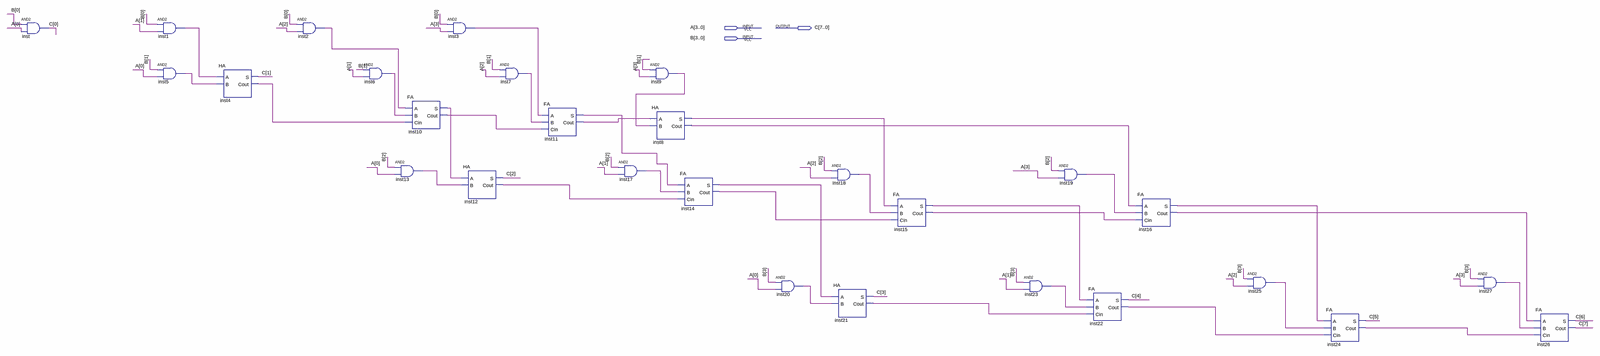
[diagram p0: schematic sheet, whole]
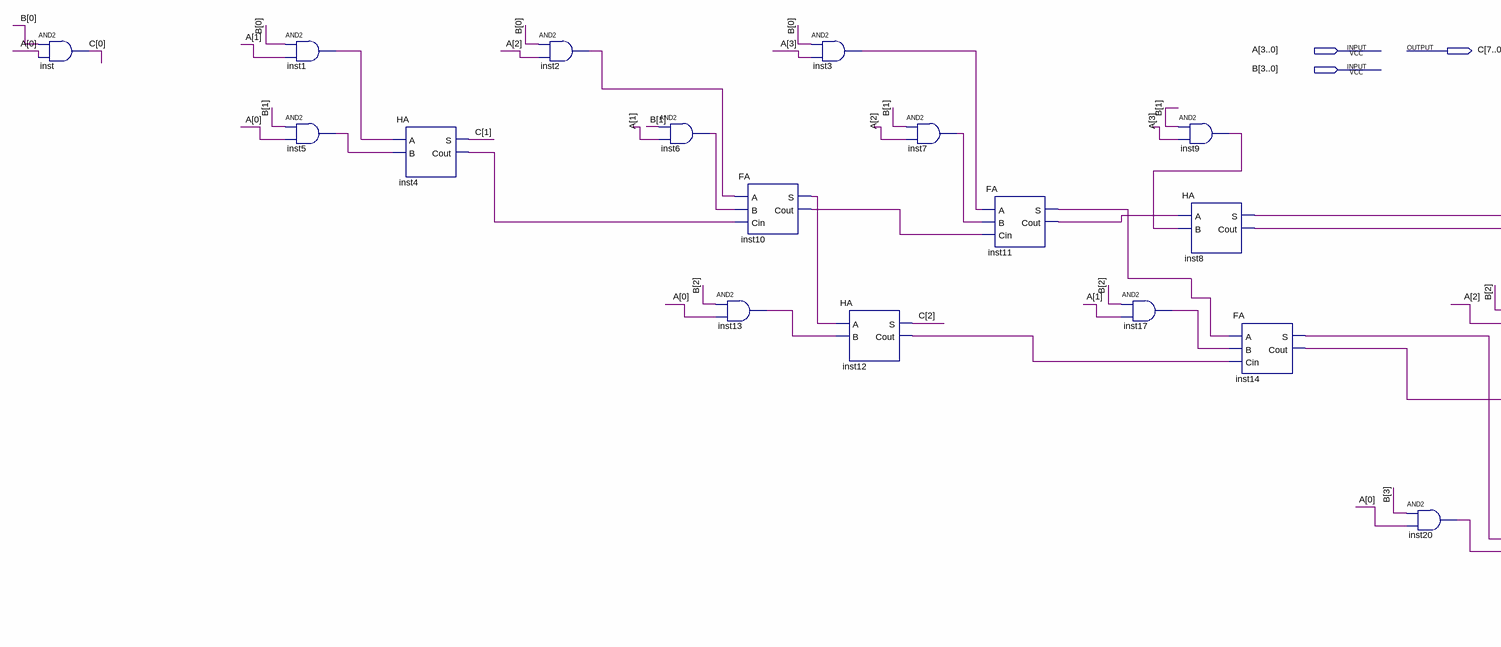
[diagram p1: schematic sheet, left part]
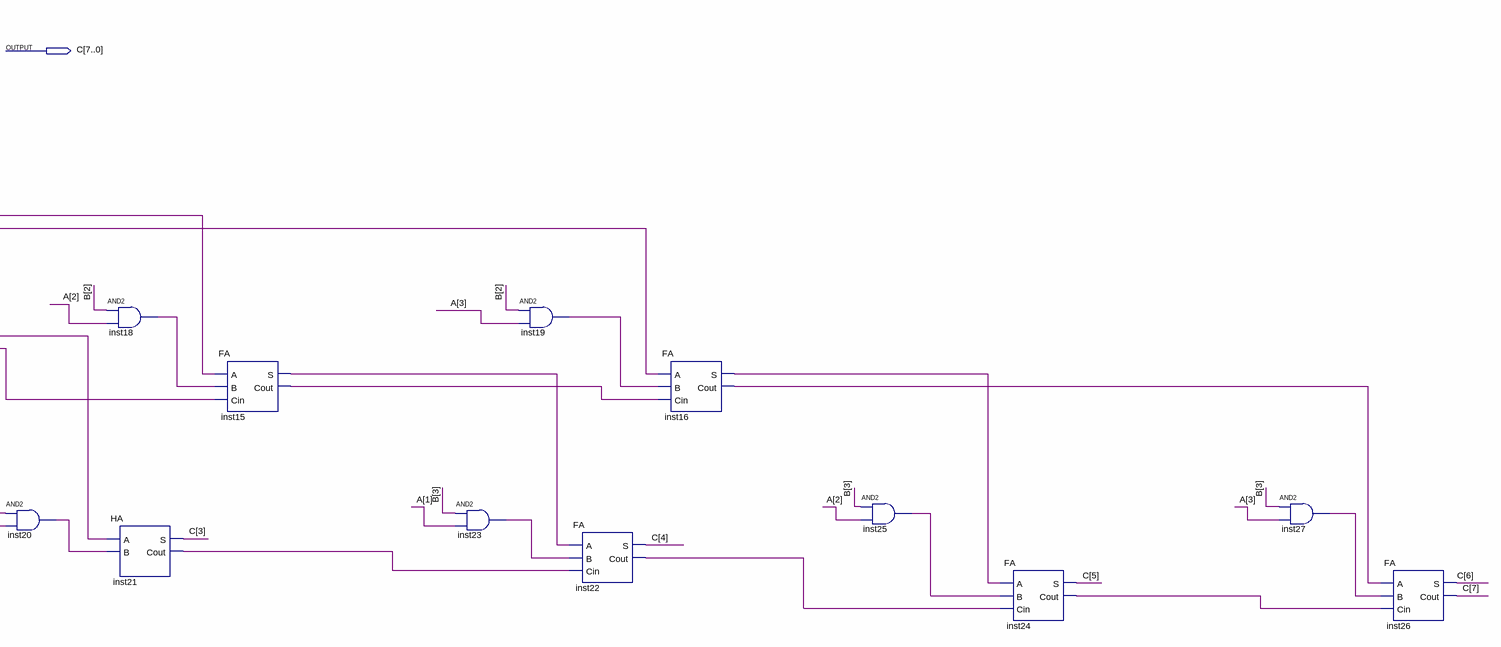
[diagram p2: schematic sheet, right part]
// Quartus schematic Multiplicador.bdf as structural Verilog: 28 symbols, 3 pins
module Multiplicador (
  input  [3:0] A,
  input  [3:0] B,
  output [7:0] C
);

  wire inst1_out, inst2_out, inst3_out, inst4_cout, inst5_out, inst6_out, inst7_out, inst8_cout, inst8_s,
       inst9_out, inst10_cout, inst10_s, inst11_cout, inst11_s, inst12_cout, inst13_out, inst14_cout,
       inst14_s, inst15_cout, inst15_s, inst16_cout, inst16_s, inst17_out, inst18_out, inst19_out,
       inst20_out, inst21_cout, inst22_cout, inst23_out, inst24_cout, inst25_out, inst27_out;

  and inst (C[0], B[0], A[0]);
  and inst1 (inst1_out, B[0], A[1]);
  and inst5 (inst5_out, B[1], A[0]);
  HA inst4 (.A(inst1_out), .B(inst5_out), .S(C[1]), .Cout(inst4_cout));
  and inst2 (inst2_out, B[0], A[2]);
  and inst6 (inst6_out, B[1], A[1]);
  FA inst10 (.A(inst2_out), .B(inst6_out), .Cin(inst4_cout), .S(inst10_s), .Cout(inst10_cout));
  and inst13 (inst13_out, B[2], A[0]);
  and inst3 (inst3_out, B[0], A[3]);
  HA inst12 (.A(inst10_s), .B(inst13_out), .S(C[2]), .Cout(inst12_cout));
  and inst7 (inst7_out, B[1], A[2]);
  FA inst11 (.A(inst3_out), .B(inst7_out), .Cin(inst10_cout), .S(inst11_s), .Cout(inst11_cout));
  and inst17 (inst17_out, B[2], A[1]);
  and inst9 (inst9_out, B[1], A[3]);
  HA inst8 (.A(inst11_cout), .B(inst9_out), .S(inst8_s), .Cout(inst8_cout));
  FA inst14 (.A(inst11_s), .B(inst17_out), .Cin(inst12_cout), .S(inst14_s), .Cout(inst14_cout));
  and inst20 (inst20_out, B[3], A[0]);
  and inst18 (inst18_out, B[2], A[2]);
  HA inst21 (.A(inst14_s), .B(inst20_out), .S(C[3]), .Cout(inst21_cout));
  FA inst15 (.A(inst8_s), .B(inst18_out), .Cin(inst14_cout), .S(inst15_s), .Cout(inst15_cout));
  and inst23 (inst23_out, B[3], A[1]);
  and inst19 (inst19_out, B[2], A[3]);
  FA inst22 (.A(inst15_s), .B(inst23_out), .Cin(inst21_cout), .S(C[4]), .Cout(inst22_cout));
  FA inst16 (.A(inst8_cout), .B(inst19_out), .Cin(inst15_cout), .S(inst16_s), .Cout(inst16_cout));
  and inst25 (inst25_out, B[3], A[2]);
  FA inst24 (.A(inst16_s), .B(inst25_out), .Cin(inst22_cout), .S(C[5]), .Cout(inst24_cout));
  and inst27 (inst27_out, B[3], A[3]);
  FA inst26 (.A(inst16_cout), .B(inst27_out), .Cin(inst24_cout), .S(C[6]), .Cout(C[7]));
endmodule
